# Altium project 6G_ISOLA.PrjPcb
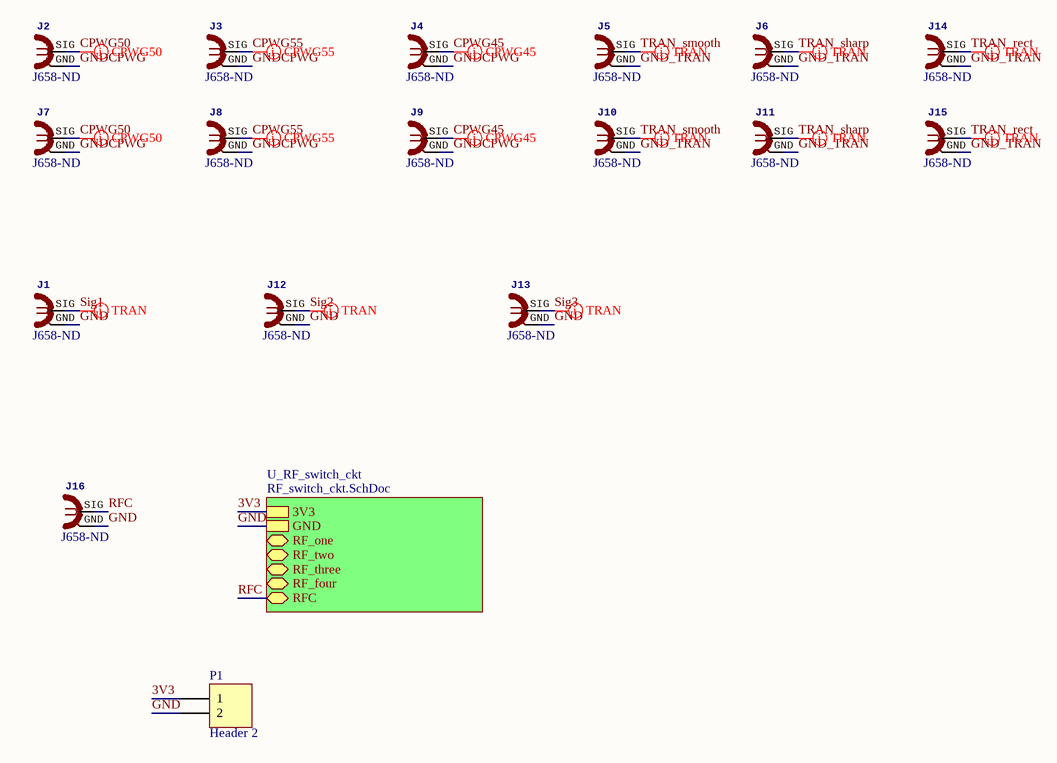
[diagram p0: 408HR_pcbminions.SchDoc]
2 sheets, 23 parts. Net scope: hierarchical (ports join the sheet entries above them; power ports are global).
Board file: 408HR_pcbminions.PcbDoc
Sheets:
  408HR_pcbminions.SchDoc
    U_RF_switch_ckt = RF_switch_ckt.SchDoc

## Sheet 408HR_pcbminions.SchDoc
size OrCAD E

### Parts
J1  Supplier Part Number 1: J658-ND  [SMA-OSHPARK-4L-1.6MM- ALT3]  (hidden comment: SMA 50 Ohm edge)
J2  Supplier Part Number 1: J658-ND  [SMA-OSHPARK-4L-1.6MM- ALT3]  (hidden comment: SMA 50 Ohm edge)
J3  Supplier Part Number 1: J658-ND  [SMA-OSHPARK-4L-1.6MM- ALT3]  (hidden comment: SMA 50 Ohm edge)
J4  Supplier Part Number 1: J658-ND  [SMA-OSHPARK-4L-1.6MM- ALT3]  (hidden comment: SMA 50 Ohm edge)
J5  Supplier Part Number 1: J658-ND  [SMA-OSHPARK-4L-1.6MM- ALT3]  (hidden comment: SMA 50 Ohm edge)
J6  Supplier Part Number 1: J658-ND  [SMA-OSHPARK-4L-1.6MM- ALT3]  (hidden comment: SMA 50 Ohm edge)
J7  Supplier Part Number 1: J658-ND  [SMA-OSHPARK-4L-1.6MM- ALT3]  (hidden comment: SMA 50 Ohm edge)
J8  Supplier Part Number 1: J658-ND  [SMA-OSHPARK-4L-1.6MM- ALT3]  (hidden comment: SMA 50 Ohm edge)
J9  Supplier Part Number 1: J658-ND  [SMA-OSHPARK-4L-1.6MM- ALT3]  (hidden comment: SMA 50 Ohm edge)
J10  Supplier Part Number 1: J658-ND  [SMA-OSHPARK-4L-1.6MM- ALT3]  (hidden comment: SMA 50 Ohm edge)
J11  Supplier Part Number 1: J658-ND  [SMA-OSHPARK-4L-1.6MM- ALT3]  (hidden comment: SMA 50 Ohm edge)
J12  Supplier Part Number 1: J658-ND  [SMA-OSHPARK-4L-1.6MM- ALT3]  (hidden comment: SMA 50 Ohm edge)
J13  Supplier Part Number 1: J658-ND  [SMA-OSHPARK-4L-1.6MM- ALT3]  (hidden comment: SMA 50 Ohm edge)
J14  Supplier Part Number 1: J658-ND  [SMA-OSHPARK-4L-1.6MM- ALT3]  (hidden comment: SMA 50 Ohm edge)
J15  Supplier Part Number 1: J658-ND  [SMA-OSHPARK-4L-1.6MM- ALT3]  (hidden comment: SMA 50 Ohm edge)
J16  Supplier Part Number 1: J658-ND  [SMA-OSHPARK-4L-1.6MM- ALT3]  (hidden comment: SMA 50 Ohm edge)
P1  Header 2  [HDR1X2]

### Sub-sheets
U_RF_switch_ckt = RF_switch_ckt.SchDoc: 3V3, GND, RF_one (bidir), RF_two (bidir), RF_three (bidir), RF_four (bidir), RFC (bidir)

### Nets
GND: J1.GND J12.GND J13.GND J16.GND P1.2 ; sheet U_RF_switch_ckt/GND
3V3: P1.1 ; sheet U_RF_switch_ckt/3V3
CPWG45: J4.SIG J9.SIG
CPWG50: J2.SIG J7.SIG
CPWG55: J3.SIG J8.SIG
GND_TRAN: J5.GND J6.GND J10.GND J11.GND J14.GND J15.GND
GNDCPWG: J2.GND J3.GND J4.GND J7.GND J8.GND J9.GND
RFC: J16.SIG ; sheet U_RF_switch_ckt/RFC
Sig1: J1.SIG
Sig2: J12.SIG
Sig3: J13.SIG
TRAN_rect: J14.SIG J15.SIG
TRAN_sharp: J6.SIG J11.SIG
TRAN_smooth: J5.SIG J10.SIG

### Layout directives
rule Impedance Constraint [Min = 50.00    Max = 50.00    ]; rule Clearance Constraint [Clearance = 10mil]; rule Width Constraint [Pref Width = 13.72mil    Min Width = 13.72mil    Max Width = 13.72mil]: CPWG50
rule Impedance Constraint [Min = 45.00    Max = 45.00    ]; rule Clearance Constraint [Clearance = 10mil]; rule Width Constraint [Pref Width = 16.41mil    Min Width = 16.41mil    Max Width = 16.41mil]: CPWG45
rule Impedance Constraint [Min = 55.00    Max = 55.00    ]; rule Clearance Constraint [Clearance = 10mil]; rule Width Constraint [Pref Width = 11.55mil    Min Width = 11.55mil    Max Width = 11.55mil]: CPWG55
rule Width Constraint [Pref Width = 13.72mil    Min Width = 13.72mil    Max Width = 13.72mil]; rule Clearance Constraint [Clearance = 10mil]: TRAN_smooth
rule Width Constraint [Pref Width = 13.72mil    Min Width = 13.72mil    Max Width = 97.138mil]; rule Clearance Constraint [Clearance = 10mil]: Sig1, Sig3, TRAN_sharp, TRAN_smooth
rule Width Constraint [Pref Width = 13.72mil    Min Width = 13.72mil    Max Width = 97.138mil]; rule Clearance Constraint [Generic clearance = 10mil, and 3 value(s) for objects]: TRAN_rect
rule Width Constraint [Pref Width = 13.72mil    Min Width = 13.72mil    Max Width = 97.138mil]; rule Clearance Constraint [Generic clearance = 10mil, and 2 value(s) for objects]: TRAN_rect
rule Width Constraint [Pref Width = 13.72mil    Min Width = 13.72mil    Max Width = 97.138mil]; rule Clearance Constraint [Generic clearance = 10mil, and 6 value(s) for objects]: Sig2

### Library data of the parts
J1-J16 = SMA-OSHPARK-4L-1.6MM-ALT3: GateName_1: G1; SymbolName_1: COAX; DeviceName: -OSHPARK-4L-1.6MM; LibraryName: dword1511-connectors; DeviceSetName: SMA; Package: SMA-OSHPARK-4L-1.6MM; Supplier 1: Digi-Key
P1 = Header 2: Header, 2-Pin; LatestRevisionDate: 17-Jul-2002; LatestRevisionNote: Re-released for DXP Platform.; Publisher: Altium Limited

## Sheet RF_switch_ckt.SchDoc
size OrCAD E
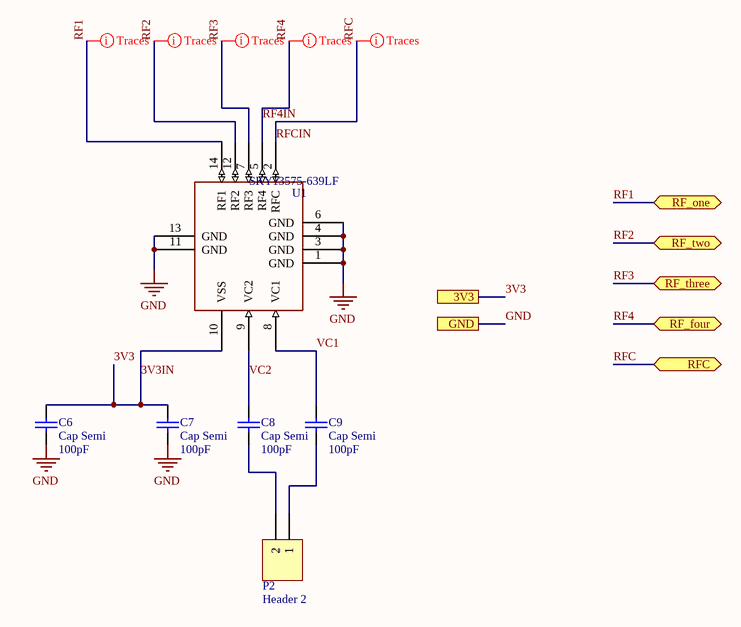
[diagram p1: RF_switch_ckt.SchDoc]

### Parts
C6  Cap Semi  value 100pF  [0402]
C7  Cap Semi  value 100pF  [0402]
C8  Cap Semi  value 100pF  [0402]
C9  Cap Semi  value 100pF  [0402]
P2  Header 2  [HDR1X2]
U1  SKY13575-639LF  [*QFN45P200X200X55-15N]

### Ports
3V3, GND, RF_four (bidir), RF_one (bidir), RF_three (bidir), RF_two (bidir), RFC (bidir)

### Nets
GND: C6.1 C7.1 U1.1(GND) U1.3(GND) U1.4(GND) U1.6(GND) U1.11(GND) U1.13(GND) ; port GND
3V3: C6.2 C7.2 U1.10(VSS) ; port 3V3  [also labelled 3V3IN]
RF1: U1.14(RF1) ; port RF_one
RF2: U1.12(RF2) ; port RF_two
RF3: U1.7(RF3) ; port RF_three
RF4: U1.5(RF4) ; port RF_four  [also labelled RF4IN]
RFC: U1.2(RFC) ; port RFC  [also labelled RFCIN]
VC1: C9.2 U1.8(VC1)
VC2: C8.2 U1.9(VC2)
NetC8_1: C8.1 P2.2
NetC9_1: C9.1 P2.1

### Layout directives
rule Width Constraint [Pref Width = 11.283mil    Min Width = 11.283mil    Max Width = 11.283mil]; rule Clearance Constraint [Generic clearance = 2mil, and 21 value(s) for objects]: RF1
rule Width Constraint [Pref Width = 11.283mil    Min Width = 11.283mil    Max Width = 11.283mil]; rule Clearance Constraint [Generic clearance = 5mil, and 5 value(s) for objects]: RF2, RF3, RF4, RFC

### Library data of the parts
C6-C9 = Cap Semi: Capacitor (Semiconductor SIM Model); Published: 8-Jun-2000; LatestRevisionDate: 29-May-2009; LatestRevisionNote: IPC-7351 Footprint Added.; PackageReference: C1206; Publisher: Altium Limited; PackageDescription: Chip Capacitor
P2 = Header 2: Header, 2-Pin; LatestRevisionDate: 17-Jul-2002; LatestRevisionNote: Re-released for DXP Platform.; Publisher: Altium Limited

## Nets that join several sheets
GND: 408HR_pcbminions (5 pins), RF_switch_ckt (8 pins)
3V3: 408HR_pcbminions (P1.1), RF_switch_ckt (C6.2 C7.2 U1.10)
RFC: 408HR_pcbminions (J16.SIG), RF_switch_ckt (U1.2)

## Assembly variants
6G_408HR_test1: all parts fitted